# Altium schematic sheet Power.SchDoc
size 420 x 297 mm; DocumentNumber: 2; SheetNumber: 2; SheetTotal: 5; Обозначение_Код: RIG-00.00.001 Э3
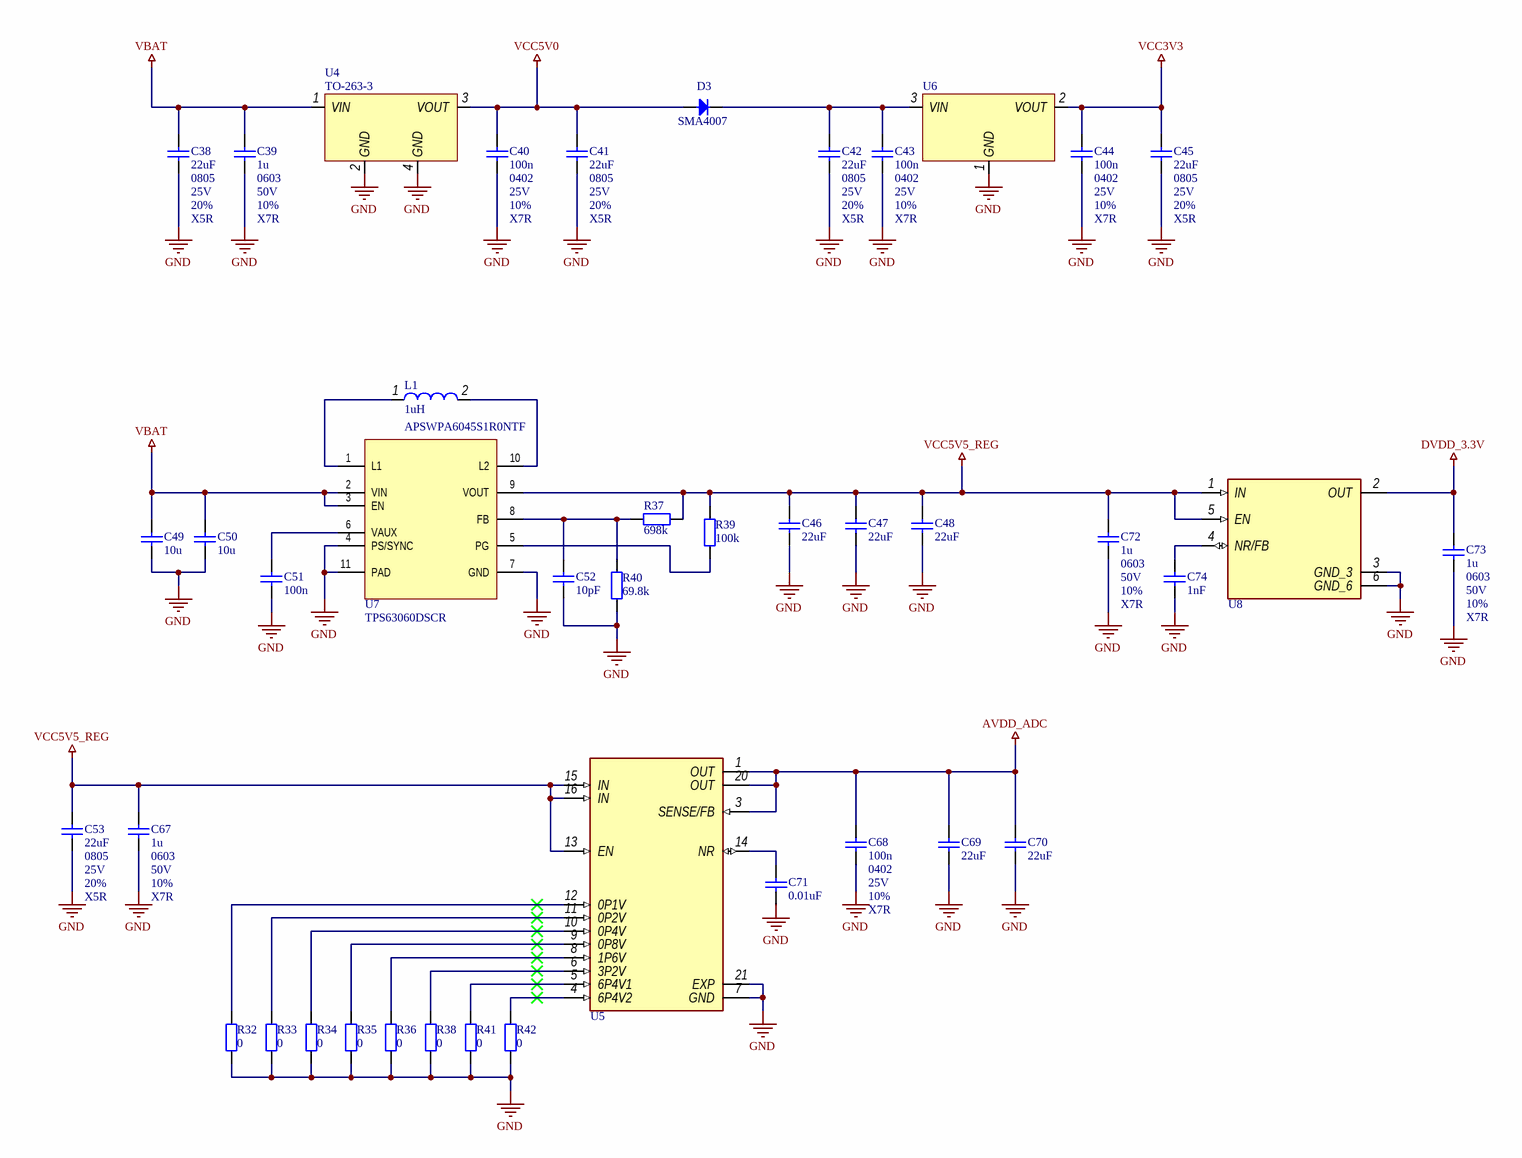
[diagram p0: Power.SchDoc]

## Parts
C38  22uF  Device: 0805  Voltage: 25V  Tolerance: 20%  Dielectric Type: X5R  [CAPC2012X135N]
C39  1u  Device: 0603  Voltage: 50V  Tolerance: 10%  Dielectric Type: X7R  [CAPC1608X85N]
C40  100n  Device: 0402  Voltage: 25V  Tolerance: 10%  Dielectric Type: X7R  [CAPC1005X55N]
C41  22uF  Device: 0805  Voltage: 25V  Tolerance: 20%  Dielectric Type: X5R  [CAPC2012X135N]
C42  22uF  Device: 0805  Voltage: 25V  Tolerance: 20%  Dielectric Type: X5R  [CAPC2012X135N]
C43  100n  Device: 0402  Voltage: 25V  Tolerance: 10%  Dielectric Type: X7R  [CAPC1005X55N]
C44  100n  Device: 0402  Voltage: 25V  Tolerance: 10%  Dielectric Type: X7R  [CAPC1005X55N]
C45  22uF  Device: 0805  Voltage: 25V  Tolerance: 20%  Dielectric Type: X5R  [CAPC2012X135N]
C46  22uF  [CAPC2012X135N]
C47  22uF  [CAPC2012X135N]
C48  22uF  [CAPC2012X135N]
C49  10u  [CAPC2012X135N]
C50  10u  [CAPC2012X135N]
C51  100n  [CAPC1005X55N]
C52  10pF  [CAPC1005X55N]
C53  22uF  Device: 0805  Voltage: 25V  Tolerance: 20%  Dielectric Type: X5R  [CAPC2012X135N]
C67  1u  Device: 0603  Voltage: 50V  Tolerance: 10%  Dielectric Type: X7R  [CAPC1608X85N]
C68  100n  Device: 0402  Voltage: 25V  Tolerance: 10%  Dielectric Type: X7R  [CAPC1005X55N]
C69  22uF  [CAPC2012X135N]
C70  22uF  [CAPC2012X135N]
C71  0.01uF  [CAPC1005X55N]
C72  1u  Device: 0603  Voltage: 50V  Tolerance: 10%  Dielectric Type: X7R  [CAPC1608X85N]
C73  1u  Device: 0603  Voltage: 50V  Tolerance: 10%  Dielectric Type: X7R  [CAPC1608X85N]
C74  1nF  [CAPC1005X55N]
D3  SMA4007  [DO-214AC]
L1  1uH  Part Number: APSWPA6045S1R0NTF  [APSWPA6045]
R32  0  [RESC1608X50N]
R33  0  [RESC1608X50N]
R34  0  [RESC1608X50N]
R35  0  [RESC1608X50N]
R36  0  [RESC1608X50N]
R37  698k  [RESC1005X40N]
R38  0  [RESC1608X50N]
R39  100k  [RESC1005X40N]
R40  69.8k  [RESC1005X40N]
R41  0  [RESC1608X50N]
R42  0  [RESC1608X50N]
U4  value TO-263-3  [TO-263-3_L8.6-W10.2-P2.54-LS14.4-BR]  (hidden comment: LM7805S)
U5  TPS7A4700RGWR  [QFN65P500X500X100-21N]  (value not drawn)
U6  AMS1117-3.3  [SOT230P700-4BN]  (value not drawn)
U7  TPS63060DSCR  [WSON10]
U8  TPS73733DCQR  [IC_TPS73733DCQR]  (value not drawn)

## Nets
AVDD_ADC: C68.2 C69.2 C70.2 U5.1(OUT) U5.3(SENSE/FB) U5.20(OUT)
DVDD_3.3V: C73.2 U8.2(OUT)
GND: C38.1 C39.1 C40.1 C41.1 C42.1 C43.1 C44.1 C45.1 C46.1 C47.1 C48.1 C49.1 C50.1 C51.1 C52.1 C53.1 C67.1 C68.1 C69.1 C70.1 C71.1 C72.1 C73.1 C74.1 R32.1 R33.1 R34.1 R35.1 R36.1 R38.1 R40.1 R41.1 R42.1 U4.2(GND) U4.4(GND) U5.7(GND) U5.21(EXP) U6.1(GND) U7.4(PS/SYNC) U7.7(GND) U7.11(PAD) U8.3(GND_3) U8.6(GND_6)
VBAT: C38.2 C39.2 C49.2 C50.2 U4.1(VIN) U7.2(VIN) U7.3(EN)
VCC3V3: C44.2 C45.2 U6.2(VOUT)
VCC5V0: C40.2 C41.2 D3.1(A) U4.3(VOUT)
VCC5V5_REG: C46.2 C47.2 C48.2 C53.2 C67.2 C72.2 R37.2 R39.2 U5.13(EN) U5.15(IN) U5.16(IN) U7.9(VOUT) U8.1(IN) U8.5(EN)
NetC42_2: C42.2 C43.2 D3.2(C) U6.3(VIN)
NetC51_2: C51.2 U7.6(VAUX)
NetC52_2: C52.2 R37.1 R40.2 U7.8(FB)
NetC71_2: C71.2 U5.14(NR)
NetC74_2: C74.2 U8.4(NR/FB)
NetL1_1: L1.1 U7.1(L1)
NetL1_2: L1.2 U7.10(L2)
NetR32_2: R32.2 U5.12(0P1V)
NetR33_2: R33.2 U5.11(0P2V)
NetR34_2: R34.2 U5.10(0P4V)
NetR35_2: R35.2 U5.9(0P8V)
NetR36_2: R36.2 U5.8(1P6V)
NetR38_2: R38.2 U5.6(3P2V)
NetR39_1: R39.1 U7.5(PG)
NetR41_2: R41.2 U5.5(6P4V1)
NetR42_2: R42.2 U5.4(6P4V2)

## Notes on the sheet
- Подп. дата
- Инв. № дубл.
- Взам. инв. №
- Подп. и дата
- Инв. № подл.
- Изм.
- Лист
- № докум.
- Подп.
- Дата
- ALTIUM GOSTBOM2.0 KEV
- Файл:
- Копировал
- Формат А3

## Library data of the parts
C38 C41 C42 C45 C53 = GRM21BR61E226ME44L: CAP CER 0805 22uF 25V X5R; Manufacturer: Murata; ID: 21; Type: Resistor; Packaging Type: Cut Tape; Working Temperature Min: -55°С; Working Temperature Max: +125°С; Table: Capacitor SMT - Керамические; Part Number: GRM21BR61E226ME44L; Value: 22uF; Series: GRM; SMD: Yes; Manufacturer Part Number: GRM21BR61E226ME44L; Datasheet URL: #https://www.terraelectronica.ru/pdf/show?pdf_file=http%253A%252F%252Fwww.farnell.com%252Fdatasheets%252F2048737.pdf#; Status: Active; Price: 0; Price2: 0; Price3: 0; Author: Arshanitsa D.; CreateDate: 17.08.2020
C39 C67 C72 C73 = CC0603KRX7R9BB105: CAP CER 0603 1u 50V X7R; Manufacturer: Yageo; ID: 12; Type: Resistor; Packaging Type: Cut Tape; Working Temperature Min: -55°С; Working Temperature Max: +125°С; Table: Capacitor SMT - Керамические; Part Number: CC0603KRX7R9BB105; Value: 1u; Series: CC; SMD: Yes; Manufacturer Part Number: CC0603KRX7R9BB105; Datasheet URL: #https://www.terraelectronica.ru/pdf/show?pdf_file=http%253A%252F%252Fwww.mouser.com%252Fds%252F2%252F447%252FUPY-GPHC_X7R_6.3V-to-50V_18-1154002.pdf#; Status: Active; Price: 0; Price2: 0; Price3: 0; Author: Krepak V.; CreateDate: 06.04.2020
C40 C43 C44 C68 = GRM155R71E104KE14D: CAP CER 0402 100n 25V X7R; Manufacturer: Murata; ID: 4; Type: Resistor; Packaging Type: Cut Tape; Working Temperature Min: -55°С; Working Temperature Max: +125°С; Table: Capacitor SMT - Керамические; Part Number: GRM155R71E104KE14D; Value: 100n; Series: GRM; SMD: Yes; Manufacturer Part Number: GRM155R71E104KE14D; Status: Active; Price: 0; Price2: 0; Price3: 0; Author: Krepak V.; CreateDate: 23.02.2020
C46-C48 C69 C70 = GRM21BR61E226ME44L: CAP CER 0805 22uF 25V X5R; Manufacturer: Murata; ID: 21; Device: 0805; Tolerance: 20%; Type: Resistor; Packaging Type: Cut Tape; Working Temperature Min: -55°С; Working Temperature Max: +125°С; Table: Capacitor SMT - Керамические; Part Number: GRM21BR61E226ME44L; Value: 22uF; Voltage: 25V; Dielectric Type: X5R; Series: GRM; SMD: Yes; Manufacturer Part Number: GRM21BR61E226ME44L; Datasheet URL: #https://www.terraelectronica.ru/pdf/show?pdf_file=http%253A%252F%252Fwww.farnell.com%252Fdatasheets%252F2048737.pdf#; Status: Active; Price: 0; Price2: 0; Price3: 0; Author: Arshanitsa D.; CreateDate: 17.08.2020
C49 C50 = GRM21BZ71E106KE15L: CAP CER 0805 10u 25V X7R; Manufacturer: Murata; ID: 5; Device: 0805; Tolerance: 10%; Type: Resistor; Packaging Type: Cut Tape; Working Temperature Min: -55°С; Working Temperature Max: +125°С; Table: Capacitor SMT - Керамические; Part Number: GRM21BZ71E106KE15L; Value: 10u; Voltage: 25V; Dielectric Type: X7R; Series: GRM; SMD: Yes; Manufacturer Part Number: GRM21BZ71E106KE15L; Status: Active; Price: 0; Price2: 0; Price3: 0; Author: Krepak V.; CreateDate: 23.02.2020
C51 = GRM155R71E104KE14D: CAP CER 0402 100n 25V X7R; Manufacturer: Murata; ID: 4; Device: 0402; Tolerance: 10%; Type: Resistor; Packaging Type: Cut Tape; Working Temperature Min: -55°С; Working Temperature Max: +125°С; Table: Capacitor SMT - Керамические; Part Number: GRM155R71E104KE14D; Value: 100n; Voltage: 25V; Dielectric Type: X7R; Series: GRM; SMD: Yes; Manufacturer Part Number: GRM155R71E104KE14D; Status: Active; Price: 0; Price2: 0; Price3: 0; Author: Krepak V.; CreateDate: 23.02.2020
C52 = CC0402JRNPO9BN100: CAP CER 0402 10pF 50V NP0; Manufacturer: Yageo; ID: 55; Device: 0402; Tolerance: 5%; Type: Resistor; Packaging Type: Tape&Reel; Working Temperature Min: -55°С; Working Temperature Max: +125°С; Table: Capacitor SMT - Керамические; Part Number: CC0402JRNPO9BN100; Value: 10pF; Voltage: 50V; Dielectric Type: NP0; Series: CC; SMD: Yes; Manufacturer Part Number: CC0402JRNPO9BN100; Datasheet URL: #https://www.yageo.com/upload/media/product/productsearch/datasheet/mlcc/UPY-GP_NP0_16V-to-50V_18.pdf#; Status: Not recommended; Price: 0; Price2: 0; Price3: 0; Author: Krepak V.; CreateDate: 22.06.2021; Supplier 1: Digikey; Supplier Part Number 1: 311-1014-2-ND
C71 = CC0402KRX7R8BB103: CAP CER 0402 0.01uF 25V X7R; Manufacturer: Yageo; ID: 65; Device: 0402; Tolerance: ±10%; Type: Resistor; Packaging Type: Tape&Reel; Working Temperature Min: -55°С; Working Temperature Max: +125°С; Table: Capacitor SMT - Керамические; Part Number: CC0402KRX7R8BB103; Value: 0.01uF; Voltage: 25V; Dielectric Type: X7R; Series: CC; SMD: Yes; Manufacturer Part Number: CC0402KRX7R8BB103; Datasheet URL: #https://www.yageo.com/upload/media/product/productsearch/datasheet/mlcc/UPY-GPHC_X7R_6.3V-to-50V_18.pdf#; Status: Active; Price: 0; Price2: 0; Price3: 0; Author: Krepak V.; CreateDate: 24.06.2021; Supplier 1: Digikey; Supplier Part Number 1: 311-1337-2-ND
C74 = C1005C0G1H102JT000F: CAP CER 0402 1nF 50V NP0; Manufacturer: TDK Corporation; ID: 67; Device: 0402; Tolerance: 5%; Type: Resistor; Packaging Type: Tape&Reel; Working Temperature Min: -55°С; Working Temperature Max: +125°С; Table: Capacitor SMT - Керамические; Part Number: C1005C0G1H102JT000F; Value: 1nF; Voltage: 50V; Dielectric Type: NP0; SMD: Yes; Manufacturer Part Number: C1005C0G1H102JT000F; Status: Active; Price: 0; Price2: 0; Price3: 0; Author: Krepak V.; CreateDate: 19.02.2024
D3 = SMA4007: DIODE SMA4007; Manufacturer: Wing Shing; ID: 1; Value: 1000V; Max Reverse Voltage: 1000VDC; Average Current: 1A; Forward Voltage: 1.1V @ 1.0A DC; Peak Pulse Current: 30A; Reverse Leakage Current: 5uA @ 25°С 1000V; Speed: Standard Recovery; Capacitance: 15pF @ 4V, 1MHz; Reverse Recovery Time: 2.5µs; Packaging Type: Cut Tape; Replacement: 1N4007FLTR, M7, S1MB-13; Working Temperature Min: -65°С; Working Temperature Max: +165°С (JT); Table: Diodes SMT - Общ; Part Number: SMA4007; Device: SMA4007; Type: Diode; SMD: Yes; Manufacturer Part Number: SMA4007; ComponentHeight: 0.96mm; Datasheet URL: #http://pdf.datasheet.live/c12a47ed/wingshing.com/SMA4007.pdf#; Status: Active; Distributor: Chipdip; Price: 0; Price2: 0; Price3: 0; DistributorURL: #https://www.chipdip.ru/product/sma4007#; Author: Krepak V.; CreateDate: 24.06.2020; LatestRevisionDate: 24.06.2020
L1 = APSWPA6045S1R0NTF: IND APSWPA6045S1R0NTF 1uH ±30%; Manufacturer: APV; ID: 16; Self Resonant: 100MHz; Rated Current: 5,6A; DC Resistance: 14mOhm Max; Inductor Type: Wirewound; Type: Inductor; Packaging Type: Tape&Reel; Working Temperature Min: -40°C; Working Temperature Max: +125°C; Table: Inductors SMT - Общ; Device: APSWPA6045S1R0NTF; Value: 1uH; Tolerance: ±30%; Series: APSWPA; SMD: Yes; Manufacturer Part Number: APSWPA6045S1R0NTF; Datasheet URL: #https://jlcpcb.com/partdetail/Apv-APSWPA6045S1R0NTF/C5363709#; Datasheet Version: 2023/03/10; Status: Active; Price: 0; Price2: 0; Price3: 0; Author: Krepak V.; CreateDate: 22.02.2024
R32-R36 R38 R41 R42 = RC0603JR-070RL: RES 0603 0 5%; Manufacturer: Yageo; ID: 25; Device: 0603; Limit Voltage: 50V; Temperature Coefficient: 100ppm; Total Power Dissipation: 0.063W; Packaging Type: Cut Tape; Library Ref 2: Resistor2; Library Ref 3: Resistor3; Library Path 2: Resistors.SchLib; Application Category: 1; Working Temperature Min: -55°С; Working Temperature Max: +155°С; Table: Resistor SMT - Постоянные; Part Number: RC0603JR-070RL; Value: 0; Tolerance: 5%; Series: RC; Type: Resistor; Material: Thick-Film; SMD: Yes; Manufacturer Part Number: RC0603JR-070RL; Datasheet URL: #https://static.chipdip.ru/lib/788/DOC004788200.pdf#; Status: Active; Price: 0; Price2: 0; Price3: 0; Author: Arshanitsa D.; CreateDate: 28.06.2020
R37 = RC0402FR-07698KL: RES 0402 698k 1%; Manufacturer: Yageo; ID: 109; Device: 0402; Limit Voltage: 50V; Temperature Coefficient: 100ppm; Total Power Dissipation: 0.0625W; Packaging Type: Cut Tape; Library Ref 2: Resistor2; Library Ref 3: Resistor3; Library Path 2: Resistors.SchLib; Application Category: 1; Working Temperature Min: -55°С; Working Temperature Max: +155°С; Table: Resistor SMT - Постоянные; Part Number: RC0402FR-07698KL; Value: 698k; Tolerance: 1%; Series: RC; Type: Resistor; Material: Thick-Film; SMD: Yes; Manufacturer Part Number: RC0402FR-07698KL; Status: Active; Price: 0; Price2: 0; Price3: 0; Author: Krepak V.; CreateDate: 09.04.2024
R39 = RC0402FR-07100KL: RES 0402 100k 1%; Manufacturer: Yageo; ID: 2; Device: 0402; Limit Voltage: 50V; Temperature Coefficient: 100ppm; Total Power Dissipation: 0.0625W; Packaging Type: Cut Tape; Library Ref 2: Resistor2; Library Ref 3: Resistor3; Library Path 2: Resistors.SchLib; Application Category: 1; Working Temperature Min: -55°С; Working Temperature Max: +155°С; Table: Resistor SMT - Постоянные; Part Number: RC0402FR-07100KL; Value: 100k; Tolerance: 1%; Series: RC; Type: Resistor; Material: Thick-Film; SMD: Yes; Price: 0; Price2: 0; Price3: 0; Author: Krepak V.; CreateDate: 23.02.2020
R40 = RC0402FR-0769K8L: RES 0402 69.8k 1%; Manufacturer: Yageo; ID: 107; Device: 0402; Limit Voltage: 75V; Temperature Coefficient: 100ppm; Total Power Dissipation: 0.0625W; Packaging Type: Tape&Reel; Library Ref 2: Resistor2; Library Ref 3: Resistor3; Library Path 2: Resistors.SchLib; Application Category: 1; Working Temperature Min: -55°С; Working Temperature Max: +155°С; Table: Resistor SMT - Постоянные; Part Number: RC0402FR-0769K8L; Value: 69.8k; Tolerance: 1%; Series: 0.0625W; Type: Resistor; Material: Thick-Film; SMD: Yes; Manufacturer Part Number: RC0402FR-0769K8L; Status: Active; Price: 0; Price2: 0; Price3: 0; Author: Krepak V.; CreateDate: 22.02.2024
U4 = LM7805S/TR: TO-263-3 Linear Voltage Regulators (LDO) ROHS; ID: 44; Table: IC - Преобразователи и модули питания; Part Number: LM7805S/TR; Device: LM7805S; Type: IC; SMD: Yes; Status: Active; Price: 0; Price2: 0; Price3: 0; Author: Krepak V.; CreateDate: 19.02.2024
U5 = TPS7A4700RGWR: 1-A, 36-V, low-noise, high-PSRR, low-dropout voltage regulator with enable 20-VQFN -40 to 125; MF: Texas Instruments; ID: 48; Table: IC - Преобразователи и модули питания; SnapEDA_Link: https://www.snapeda.com/parts/TPS7A4700RGWR/Texas%20Instruments/view-part/424142/?ref=snap; Availability: Good; Purchase-URL: https://pricing.snapeda.com/search/part/TPS7A4700RGWR/?ref=eda; Package: VQFN-20 Texas Instruments; Price: 0; MP: TPS7A4700RGWR; Part Number: TPS7A4700RGWR; Device: TPS7A4700RGWR; Type: IC; SMD: Yes; Price2: 0; Price3: 0; Author: Krepak V.; CreateDate: 05.04.2024
U6 = AMS1117-3.3: ID: 25; Table: IC - Преобразователи и модули питания; Part Number: AMS1117-3.3; Device: AMS1117-3.3; Type: IC; SMD: Yes; Price: 0; Price2: 0; Price3: 0
U7 = TPS63060DSCR: Buck-boost type Adjustable 2.5V~8V 2A 2.5V~12V DFN-10(3x3) DC-DC Converters ROHS; Manufacturer: Texas Instruments; ID: 46; Value: WSON (10); Input Voltage: 2.5 V to 12 V; Number of Outputs: 1; Operation Frequency: 2.4 MHz; Packaging Type: Tape&Reel; Working Temperature Min: -40°C; Working Temperature Max: +85°C; Table: IC - Преобразователи и модули питания; Part Number: TPS63060DSCR; Device: TPS63060DSCR; Function: Buck-Boost; Topology: Buck-Boost; Type: IC; SMD: Yes; Manufacturer Part Number: TPS63060DSCR; Datasheet Version: https://www.ti.com/lit/ds/symlink/tps63060.pdf?HQS=dis-dk-null-digikeymode-dsf-pf-null-wwe&ts=1708584012537&ref_url=https%253A%252F%252Fwww.ti.com%252Fgeneral%252Fdocs%252Fsuppproductinfo.tsp%253FdistId%253D10%2526gotoUrl%253Dhttps%253A%252F%252Fwww.ti.com%252Flit%252Fgpn%252Ftps63060; Status: Active; Price: 0; Price2: 0; Price3: 0; Author: Krepak V.; CreateDate: 22.02.2024
U8 = TPS73733DCQR: 1-A, ultra-low-dropout voltage regulator with reverse current protection & enable 6-SOT-223 -40 to 125; ID: 49; Table: IC - Преобразователи и модули питания; Price: 0; Availability: Unavailable; MP: TPS73733DCQR; Package: None; Part Number: TPS73733DCQR; Device: TPS73733DCQR; Type: IC; SMD: Yes; Price2: 0; Price3: 0; Author: Krepak V.; CreateDate: 05.04.2024